# Altium schematic sheet TUDSSL_condenar__Hardware_PCBs_Misc_Apo4devkit2COM50_Schematic1__4_SSD.schdoc
size 309 x 223 mm; Symbol: Sheet-Symbol_A4; Device: Sheet-Symbol_A4; Company: EasyEDA.com; Drawed: EasyEDA Pro; Reviewed: EasyEDA Pro; Version: V0.1; Page Size: A4; @Project Name: TUD-EnergyHarvestingConsole_2022-08-29_17-01-09; @Page Count: 4; @Update Date: 2022-11-22; @Create Date: 2022-11-19; @Schematic Name: Schematic1; Part Number: JLCPCB-002; @Page No: 1; @Page Name: SSD
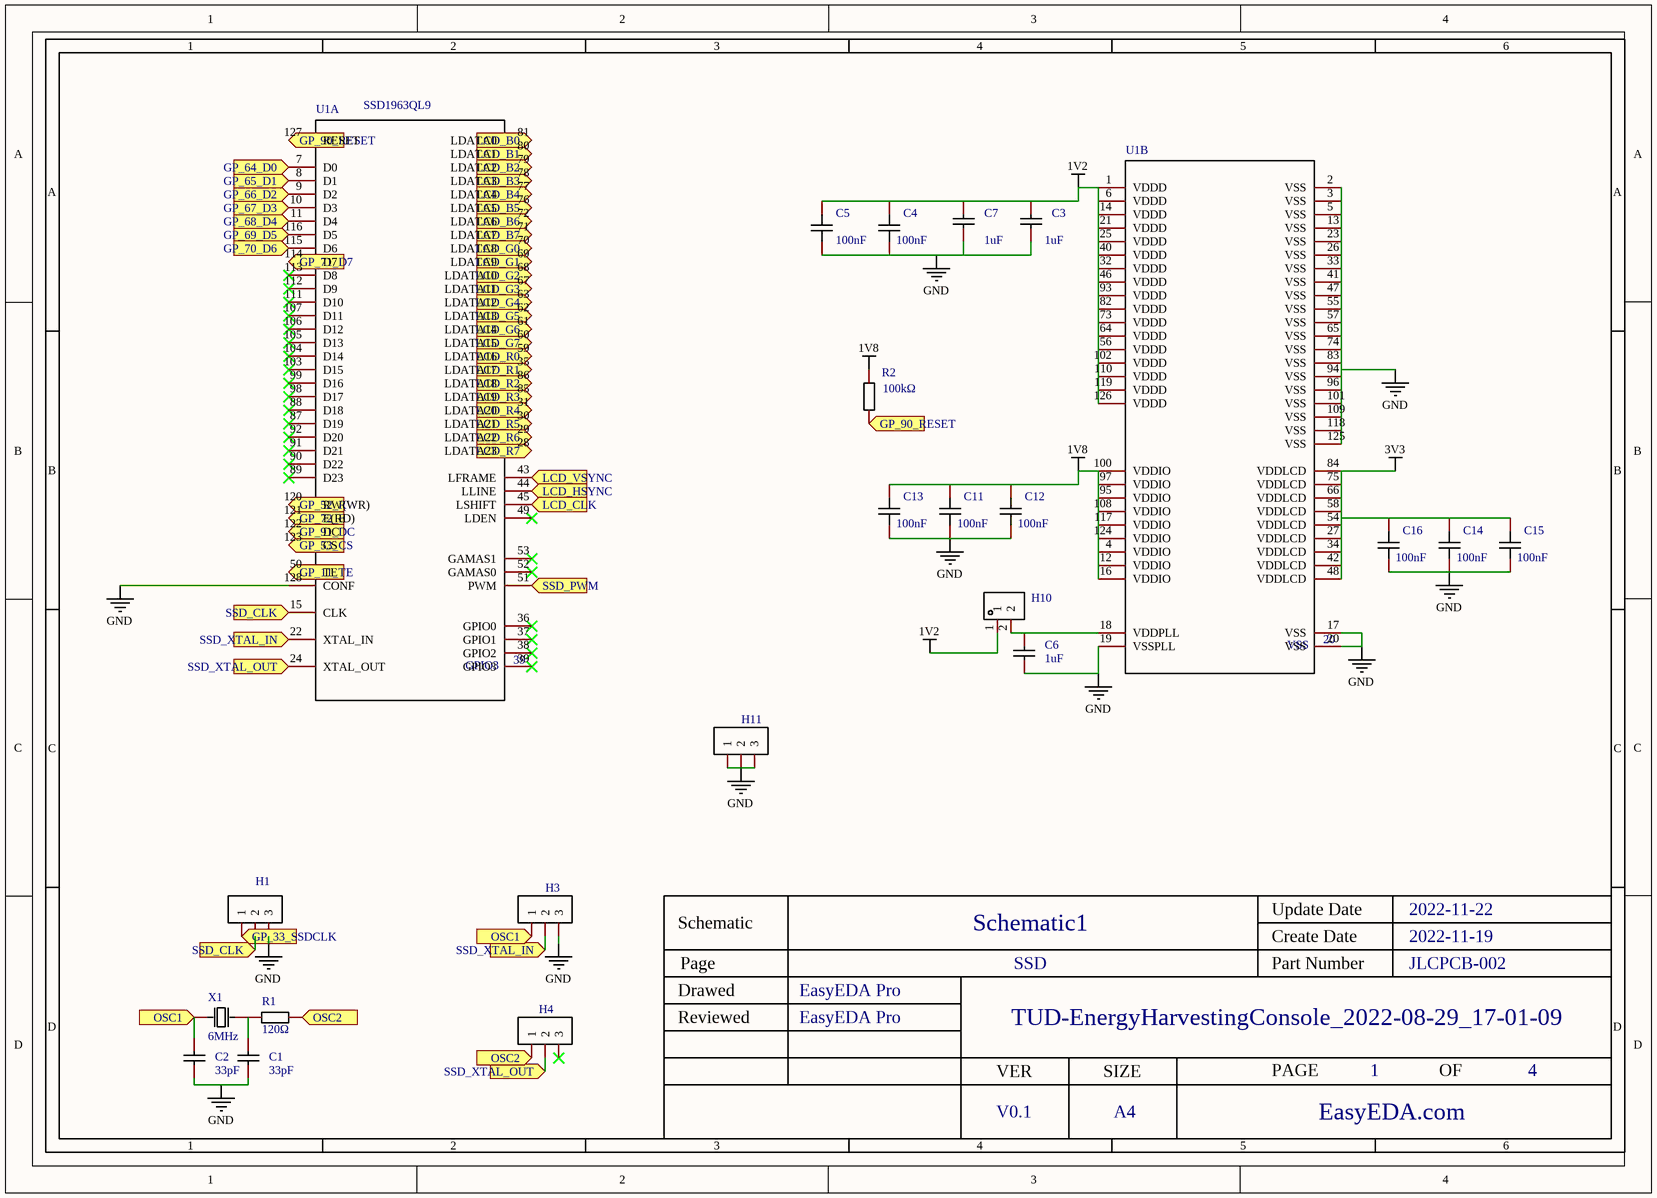
[diagram p0: TUDSSL_condenar__Hardware_PCBs_Misc_Apo4devkit2COM50_Schematic1__4_SSD.schdoc]

## Parts
C1  value 33pF  [C0805]  (hidden comment: CC0805JRNPO9BN330)
C2  value 33pF  [C0805]  (hidden comment: CC0805JRNPO9BN330)
C3  value 1uF  [C0603]  (hidden comment: CL10A105KB8NNNC)
C4  value 100nF  [C0603]  (hidden comment: CC0603KRX7R9BB104)
C5  value 100nF  [C0603]  (hidden comment: CC0603KRX7R9BB104)
C6  value 1uF  [C0603]  (hidden comment: CL10A105KB8NNNC)
C7  value 1uF  [C0603]  (hidden comment: CL10A105KB8NNNC)
C11  value 100nF  [C0603]  (hidden comment: CC0603KRX7R9BB104)
C12  value 100nF  [C0603]  (hidden comment: CC0603KRX7R9BB104)
C13  value 100nF  [C0603]  (hidden comment: CC0603KRX7R9BB104)
C14  value 100nF  [C0603]  (hidden comment: CC0603KRX7R9BB104)
C15  value 100nF  [C0603]  (hidden comment: CC0603KRX7R9BB104)
C16  value 100nF  [C0603]  (hidden comment: CC0603KRX7R9BB104)
H1  2.54-1*3P针  [HDR-TH_3P-P2.54-V-M-1]  (value not drawn)
H3  2.54-1*3P针  [HDR-TH_3P-P2.54-V-M-1]  (value not drawn)
H4  2.54-1*3P针  [HDR-TH_3P-P2.54-V-M-1]  (value not drawn)
H10  PZ254V-11-02P  [HDR-TH_2P-P2.54-V-M]  (value not drawn)
H11  2.54-1*3P针  [HDR-TH_3P-P2.54-V-M-1]  (value not drawn)
R1  value 120Ω  [R0603]  (hidden comment: 0603WAF1200T5E)
R2  value 100kΩ  [R0603]  (hidden comment: 0603WAF1003T5E)
U1  NAME: GPIO3  NUMBER: 39  [LQFP-128_L14.0-W14.0-P0.40-LS16.0-BL]  (hidden comment: SSD1963QL9)  (parts A,B of 2)
X1  value 6MHz  [HC-49S_L11.4-W4.8]  (hidden comment: 6CS06000F20UCG)

## Ports
GP_11_TE (in), GP_33_SSDCLK (in), GP_52_RW (in), GP_53_CS (in), GP_64_D0 (in), GP_65_D1 (in), GP_66_D2 (in), GP_67_D3 (in), GP_68_D4 (in), GP_69_D5 (in), GP_70_D6 (in), GP_71_D7 (in), GP_72_E (in), GP_90_RESET (in), GP_91_DC (in), LCD_B0 (in), LCD_B1 (in), LCD_B2 (in), LCD_B3 (in), LCD_B4 (in), LCD_B5 (in), LCD_B6 (in), LCD_B7 (in), LCD_CLK (in), LCD_G0 (in), LCD_G1 (in), LCD_G2 (in), LCD_G3 (in), LCD_G4 (in), LCD_G5 (in), LCD_G6 (in), LCD_G7 (in), LCD_HSYNC (in), LCD_R0 (in), LCD_R1 (in), LCD_R2 (in), LCD_R3 (in), LCD_R4 (in), LCD_R5 (in), LCD_R6 (in), LCD_R7 (in), LCD_VSYNC (in), OSC1 (in), OSC2 (in), SSD_CLK (in), SSD_PWM (in), SSD_XTAL_IN (in), SSD_XTAL_OUT (in)

## Nets
1V2: C3.2 C4.2 C5.2 C7.2 H10.1 U1.1(VDDD) U1.6(VDDD) U1.14(VDDD) U1.21(VDDD) U1.25(VDDD) U1.32(VDDD) U1.40(VDDD) U1.46(VDDD) U1.56(VDDD) U1.64(VDDD) U1.73(VDDD) U1.82(VDDD) U1.93(VDDD) U1.102(VDDD) U1.110(VDDD) U1.119(VDDD) U1.126(VDDD)
1V8: C11.2 C12.2 C13.2 R2.2 U1.4(VDDIO) U1.12(VDDIO) U1.16(VDDIO) U1.95(VDDIO) U1.97(VDDIO) U1.100(VDDIO) U1.108(VDDIO) U1.117(VDDIO) U1.124(VDDIO)
3V3: C14.2 C15.2 C16.2 U1.27(VDDLCD) U1.34(VDDLCD) U1.42(VDDLCD) U1.48(VDDLCD) U1.54(VDDLCD) U1.58(VDDLCD) U1.66(VDDLCD) U1.75(VDDLCD) U1.84(VDDLCD)
GND: C1.1 C2.1 C3.1 C4.1 C5.1 C6.1 C7.1 C11.1 C12.1 C13.1 C14.1 C15.1 C16.1 H1.3 H3.3 H11.1 H11.2 H11.3 U1.2(VSS) U1.3(VSS) U1.5(VSS) U1.13(VSS) U1.17(VSS) U1.19(VSSPLL) U1.20(VSS) U1.23(VSS) U1.26(VSS) U1.33(VSS) U1.41(VSS) U1.47(VSS) U1.55(VSS) U1.57(VSS) U1.65(VSS) U1.74(VSS) U1.83(VSS) U1.94(VSS) U1.96(VSS) U1.101(VSS) U1.109(VSS) U1.118(VSS) U1.125(VSS) U1.128(CONF)
GP_11_TE: U1.50(TE) ; port GP_11_TE
GP_33_SSDCLK: H1.1 ; port GP_33_SSDCLK
GP_52_RW: U1.120(RW(WR)) ; port GP_52_RW
GP_53_CS: U1.123(CS) ; port GP_53_CS
GP_64_D0: U1.7(D0) ; port GP_64_D0
GP_65_D1: U1.8(D1) ; port GP_65_D1
GP_66_D2: U1.9(D2) ; port GP_66_D2
GP_67_D3: U1.10(D3) ; port GP_67_D3
GP_68_D4: U1.11(D4) ; port GP_68_D4
GP_69_D5: U1.116(D5) ; port GP_69_D5
GP_70_D6: U1.115(D6) ; port GP_70_D6
GP_71_D7: U1.114(D7) ; port GP_71_D7
GP_72_E: U1.121(E(RD)) ; port GP_72_E
GP_90_RESET: R2.1 U1.127(RESET) ; port GP_90_RESET
GP_91_DC: U1.122(DC) ; port GP_91_DC
LCD_B0: U1.81(LDATA0) ; port LCD_B0
LCD_B1: U1.80(LDATA1) ; port LCD_B1
LCD_B2: U1.79(LDATA2) ; port LCD_B2
LCD_B3: U1.78(LDATA3) ; port LCD_B3
LCD_B4: U1.77(LDATA4) ; port LCD_B4
LCD_B5: U1.76(LDATA5) ; port LCD_B5
LCD_B6: U1.72(LDATA6) ; port LCD_B6
LCD_B7: U1.71(LDATA7) ; port LCD_B7
LCD_CLK: U1.45(LSHIFT) ; port LCD_CLK
LCD_G0: U1.70(LDATA8) ; port LCD_G0
LCD_G1: U1.69(LDATA9) ; port LCD_G1
LCD_G2: U1.68(LDATA10) ; port LCD_G2
LCD_G3: U1.67(LDATA11) ; port LCD_G3
LCD_G4: U1.63(LDATA12) ; port LCD_G4
LCD_G5: U1.62(LDATA13) ; port LCD_G5
LCD_G6: U1.61(LDATA14) ; port LCD_G6
LCD_G7: U1.60(LDATA15) ; port LCD_G7
LCD_HSYNC: U1.44(LLINE) ; port LCD_HSYNC
LCD_R0: U1.59(LDATA16) ; port LCD_R0
LCD_R1: U1.35(LDATA17) ; port LCD_R1
LCD_R2: U1.86(LDATA18) ; port LCD_R2
LCD_R3: U1.85(LDATA19) ; port LCD_R3
LCD_R4: U1.31(LDATA20) ; port LCD_R4
LCD_R5: U1.30(LDATA21) ; port LCD_R5
LCD_R6: U1.29(LDATA22) ; port LCD_R6
LCD_R7: U1.28(LDATA23) ; port LCD_R7
LCD_VSYNC: U1.43(LFRAME) ; port LCD_VSYNC
OSC1: C2.2 H3.1 X1.1(OSC1) ; port OSC1
OSC2: H4.1 R1.2 ; port OSC2
SSD_CLK: H1.2 U1.15(CLK) ; port SSD_CLK
SSD_PWM: U1.51(PWM) ; port SSD_PWM
SSD_XTAL_IN: H3.2 U1.22(XTAL_IN) ; port SSD_XTAL_IN
SSD_XTAL_OUT: H4.2 U1.24(XTAL_OUT) ; port SSD_XTAL_OUT
NetC1_2: C1.2 R1.1 X1.2(OSC2)
NetC6_2: C6.2 H10.2 U1.18(VDDPLL)

Not connected (* = marked no-connect by the designer): H4 3*; U1 36(GPIO0)* 37(GPIO1)* 38(GPIO2)* 39(GPIO3)* 49(LDEN)* 52(GAMAS0)* 53(GAMAS1)* 87(D19)* 88(D18)* 89(D23)* 90(D22)* 91(D21)* 92(D20)* 98(D17)* 99(D16)* 103(D15)* 104(D14)* 105(D13)* 106(D12)* 107(D11)* 111(D10)* 112(D9)* 113(D8)*

## Notes on the sheet
- 1
- 2
- 3
- 4
- 5
- 6
- A
- B
- C
- Schematic
- Schematic1
- Create Date
- Update Date
- 2022-11-22
- 2022-11-19
- Reviewed
- Drawed
- Page
- EasyEDA Pro
- SSD
- Part Number
- TUD-EnergyHarvestingConsole_2022-08-29_17-01-09
- JLCPCB-002
- D
- VER
- SIZE
- PAGE
- OF
- V0.1
- A4
- EasyEDA.com

## Library data of the parts
C1 C2 = CC0805JRNPO9BN330: Capacitance: Tolerance:±5% Tolerance:±5% Voltage Rated: Temperature Coefficient:; Manufacturer: YAGEO(国巨); Add into BOM: yes; Tolerance: ±5%; Name: 33pF; Symbol: CC0805JRNPO9BN330; Device: CC0805JRNPO9BN330; LCSC Part Name: 33pF ±5% 50V; Supplier Part: C107115; Manufacturer Part: CC0805JRNPO9BN330; Supplier Footprint: 0805; JLCPCB Part Class: Basic Part; Datasheet: https://atta.szlcsc.com/upload/public/pdf/source/20170420/1492670736688.pdf; Supplier: LCSC; Convert to PCB: yes
C3 C6 C7 = CL10A105KB8NNNC: Temperature Coefficient: Tolerance: Tolerance: Voltage Rated: Capacitance:; Manufacturer: SAMSUNG(三星); Add into BOM: yes; Name: 1uF; Symbol: CL10A105KB8NNNC; Device: CL10A105KB8NNNC; LCSC Part Name: 1uF(105) ±10% 50V; Supplier Part: C15849; Manufacturer Part: CL10A105KB8NNNC; Supplier Footprint: 0603; JLCPCB Part Class: Basic Part; Datasheet: https://atta.szlcsc.com/upload/public/pdf/source/20160103/1457707679084.pdf; Supplier: LCSC; Convert to PCB: yes
C4 C5 C11-C16 = CC0603KRX7R9BB104: Capacitance: Tolerance:±10% Tolerance:±10% Voltage Rated: Temperature Coefficient:; Manufacturer: YAGEO(国巨); Add into BOM: yes; Tolerance: ±10%; Name: 100nF; Symbol: CC0603KRX7R9BB104; Device: CC0603KRX7R9BB104; LCSC Part Name: 100nF ±10% 50V; Supplier Part: C14663; Manufacturer Part: CC0603KRX7R9BB104; Supplier Footprint: 0603; JLCPCB Part Class: Basic Part; Datasheet: https://atta.szlcsc.com/upload/public/pdf/source/20170116/1484561234239.pdf; Supplier: LCSC; Convert to PCB: yes
H1 H3 H4 H11 = 2.54-1*3P针: Pitch:2.54mm Number of Pins:3 Number of Rows: Pin Structure:1x3P Row Spacing:- Mounting Type:Straight Circluar Pins/Square Pins:Square Pins Current Rating (Max):3A Voltage Rating (Max):- Length of Mating Pin:- Insulation Height:- Length of End Connection; Manufacturer: BOOMELE(博穆精密); Symbol: Header-Male-2.54_1x3; Add into BOM: yes; Pitch: 2.54mm; Pin Structure: 1x3P; Current Rating (Max): 3A; Name: 2.54-1*3P针; Device: 2.54-1*3P针; LCSC Part Name: 2.54mm 1x3P 直插 方针; Supplier Part: C49257; Manufacturer Part: 2.54-1*3P针; Supplier Footprint: 插件,P=2.54mm; JLCPCB Part Class: Extended Part; Datasheet: https://atta.szlcsc.com/upload/public/pdf/source/20151109/1457707570948.pdf; Supplier: LCSC; Convert to PCB: yes; Number of Pins: 3; Row Spacing: -; Mounting Type: Straight; Circluar Pins/Square Pins: Square Pins; Voltage Rating (Max): -; Length of Mating Pin: -; Insulation Height: -; Length of End Connection Pin: -; Contact Plating: -; Operating Temperature Range: -40~+105; Color: Black
H10 = PZ254V-11-02P: Pitch:2.54mm Number of Pins:2 Number of Rows: Pin Structure:1x2P Row Spacing:- Mounting Type:Straight Circluar Pins/Square Pins:Square Pins Current Rating (Max):- Voltage Rating (Max):- Length of Mating Pin:6mm Insulation Height:2.5mm Length of End Connec; Manufacturer: XFCN(兴飞); Add into BOM: yes; Pitch: 2.54mm; Pin Structure: 1x2P; Name: PZ254V-11-02P; Symbol: PZ254V-11-02P; Device: PZ254V-11-02P; LCSC Part Name: 2.54mm 1x2P 直插 方针; Supplier Part: C492401; Manufacturer Part: PZ254V-11-02P; Supplier Footprint: 插件,P=2.54mm; JLCPCB Part Class: Extended Part; Datasheet: https://atta.szlcsc.com/upload/public/pdf/source/20200309/C492401_A812433581A9B211A7FFA413ADDFF0E5.pdf; Supplier: LCSC; Convert to PCB: yes; Number of Pins: 2; Row Spacing: -; Mounting Type: Straight; Circluar Pins/Square Pins: Square Pins; Current Rating (Max): -; Voltage Rating (Max): -; Length of Mating Pin: 6mm; Insulation Height: 2.5mm; Length of End Connection Pin: 3mm; Contact Plating: -; Operating Temperature Range: -40~+105; Color: Black
R1 = 0603WAF1200T5E: Type:Thick Film Resistors Resistance: Tolerance:±1% Tolerance:±1% Power(Watts): Temperature Coefficient:±100ppm/ Temperature Coefficient:±100ppm/ Overload Voltage (Max): Operating Temperature Range:-55~+155 Operating Temperature Range:-55~+155; Manufacturer: UNI-ROYAL(厚声); Add into BOM: yes; Tolerance: ±1%; Name: 120Ω; Symbol: 0603WAF1200T5E; Device: 0603WAF1200T5E; LCSC Part Name: 120Ω ±1% 100mW; Supplier Part: C22787; Manufacturer Part: 0603WAF1200T5E; Supplier Footprint: 0603; JLCPCB Part Class: Basic Part; Datasheet: https://atta.szlcsc.com/upload/public/pdf/source/20200306/C422600_1E6D84923E4A46A82E41ADD87F860B5C.pdf; Supplier: LCSC; Convert to PCB: yes; Type: Thick Film Resistors; Temperature Coefficient: ±100ppm/; Operating Temperature Range: -55~+155
R2 = 0603WAF1003T5E: Type:Thick Film Resistors Resistance: Tolerance:±1% Tolerance:±1% Power(Watts): Temperature Coefficient:±100ppm/ Temperature Coefficient:±100ppm/ Overload Voltage (Max): Operating Temperature Range:-55~+155 Operating Temperature Range:-55~+155; Manufacturer: UNI-ROYAL(厚声); Add into BOM: yes; Tolerance: ±1%; Name: 100kΩ; Symbol: 0603WAF1003T5E; Device: 0603WAF1003T5E; LCSC Part Name: 100kΩ ±1% 100mW; Supplier Part: C25803; Manufacturer Part: 0603WAF1003T5E; Supplier Footprint: 0603; JLCPCB Part Class: Basic Part; Datasheet: https://atta.szlcsc.com/upload/public/pdf/source/20200306/C422600_1E6D84923E4A46A82E41ADD87F860B5C.pdf; Supplier: LCSC; Convert to PCB: yes; Type: Thick Film Resistors; Temperature Coefficient: ±100ppm/; Operating Temperature Range: -55~+155
U1 = SSD1963QL9: Manufacturer: SOLOMON(晶门科技); Add into BOM: yes; Name: SSD1963QL9; Symbol: SSD1963QL9; Device: SSD1963QL9; LCSC Part Name: SSD1963QL9; Supplier Part: C15216; Manufacturer Part: SSD1963QL9; Supplier Footprint: LQFP-128_14x14x04P; JLCPCB Part Class: Extended Part; Datasheet: https://atta.szlcsc.com/upload/public/pdf/source/20140321/1457707026315.pdf; Supplier: LCSC; Convert to PCB: yes
X1 = 6CS06000F20UCG: Crystal Type: Frequency: Frequency Tolerance:±20ppm Frequency Tolerance:±20ppm Frequency Stability:±30ppm Frequency Stability:±30ppm Load Capacitance: Operating Temperature: Operating Temperature:; Manufacturer: SJK(晶科鑫); Add into BOM: yes; Frequency Tolerance: ±20ppm; Frequency Stability: ±30ppm; Name: 6MHz; Symbol: 6CS06000F20UCG; Device: 6CS06000F20UCG; LCSC Part Name: 6MHz ±20ppm 20pF; Supplier Part: C252308; Manufacturer Part: 6CS06000F20UCG; Supplier Footprint: HC-49S-SMD-2P; JLCPCB Part Class: Extended Part; Datasheet: https://atta.szlcsc.com/upload/public/pdf/source/20220727/B56A36B536E14A7E1EEE384A5DE078CB.pdf; Supplier: LCSC; Convert to PCB: yes